# Altium schematic sheet 门禁改.SchDoc
size D
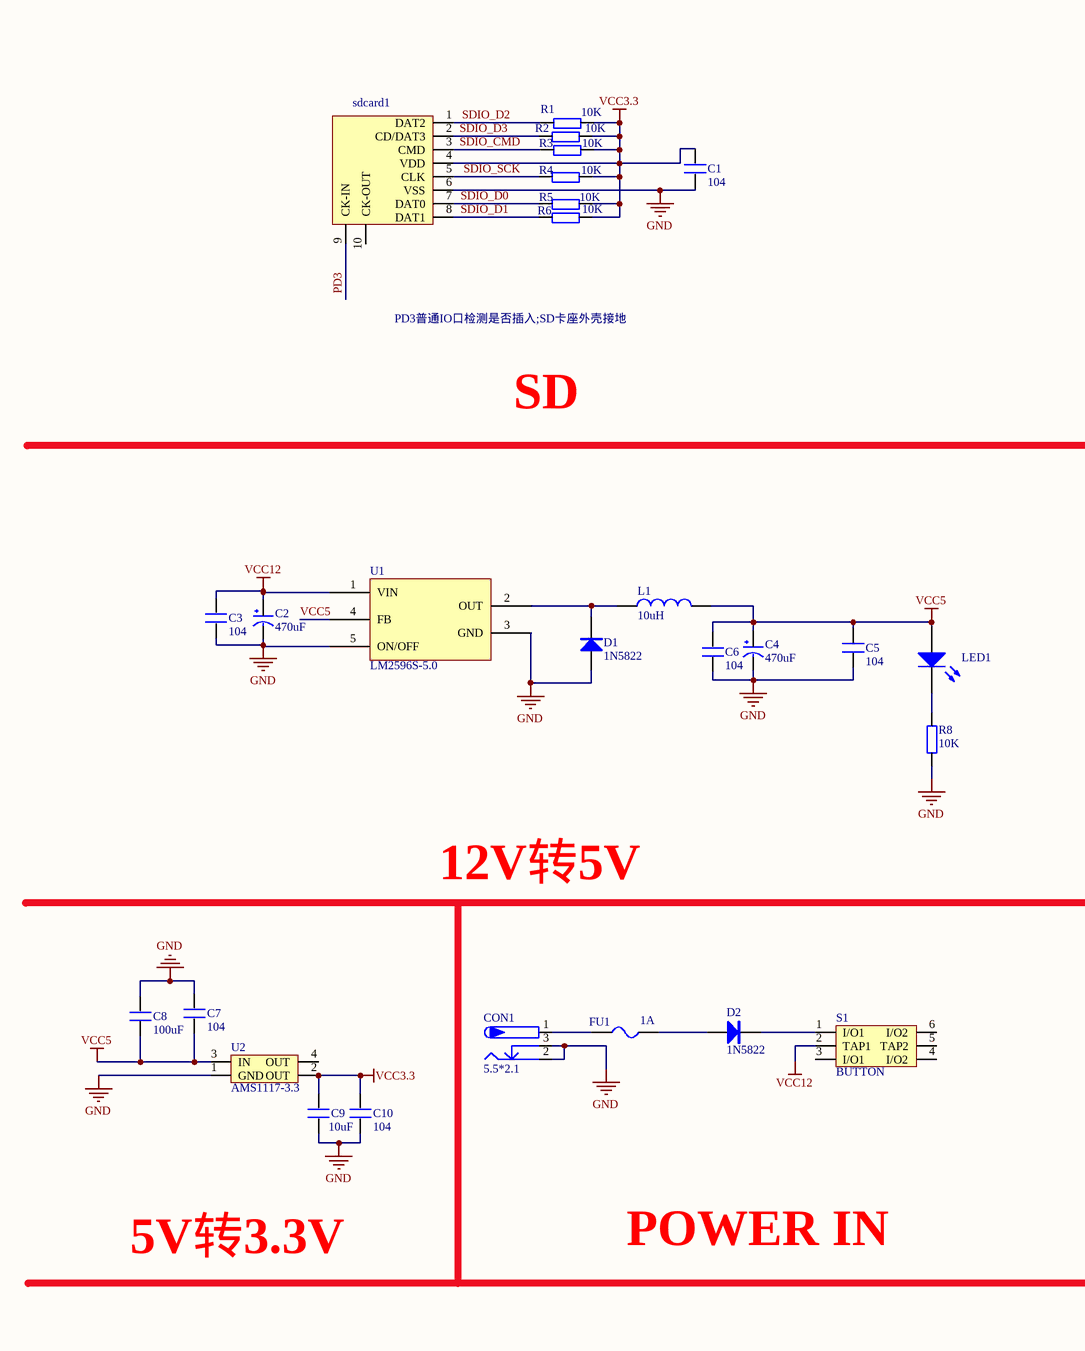
[diagram p0: 门禁改.SchDoc, top left]
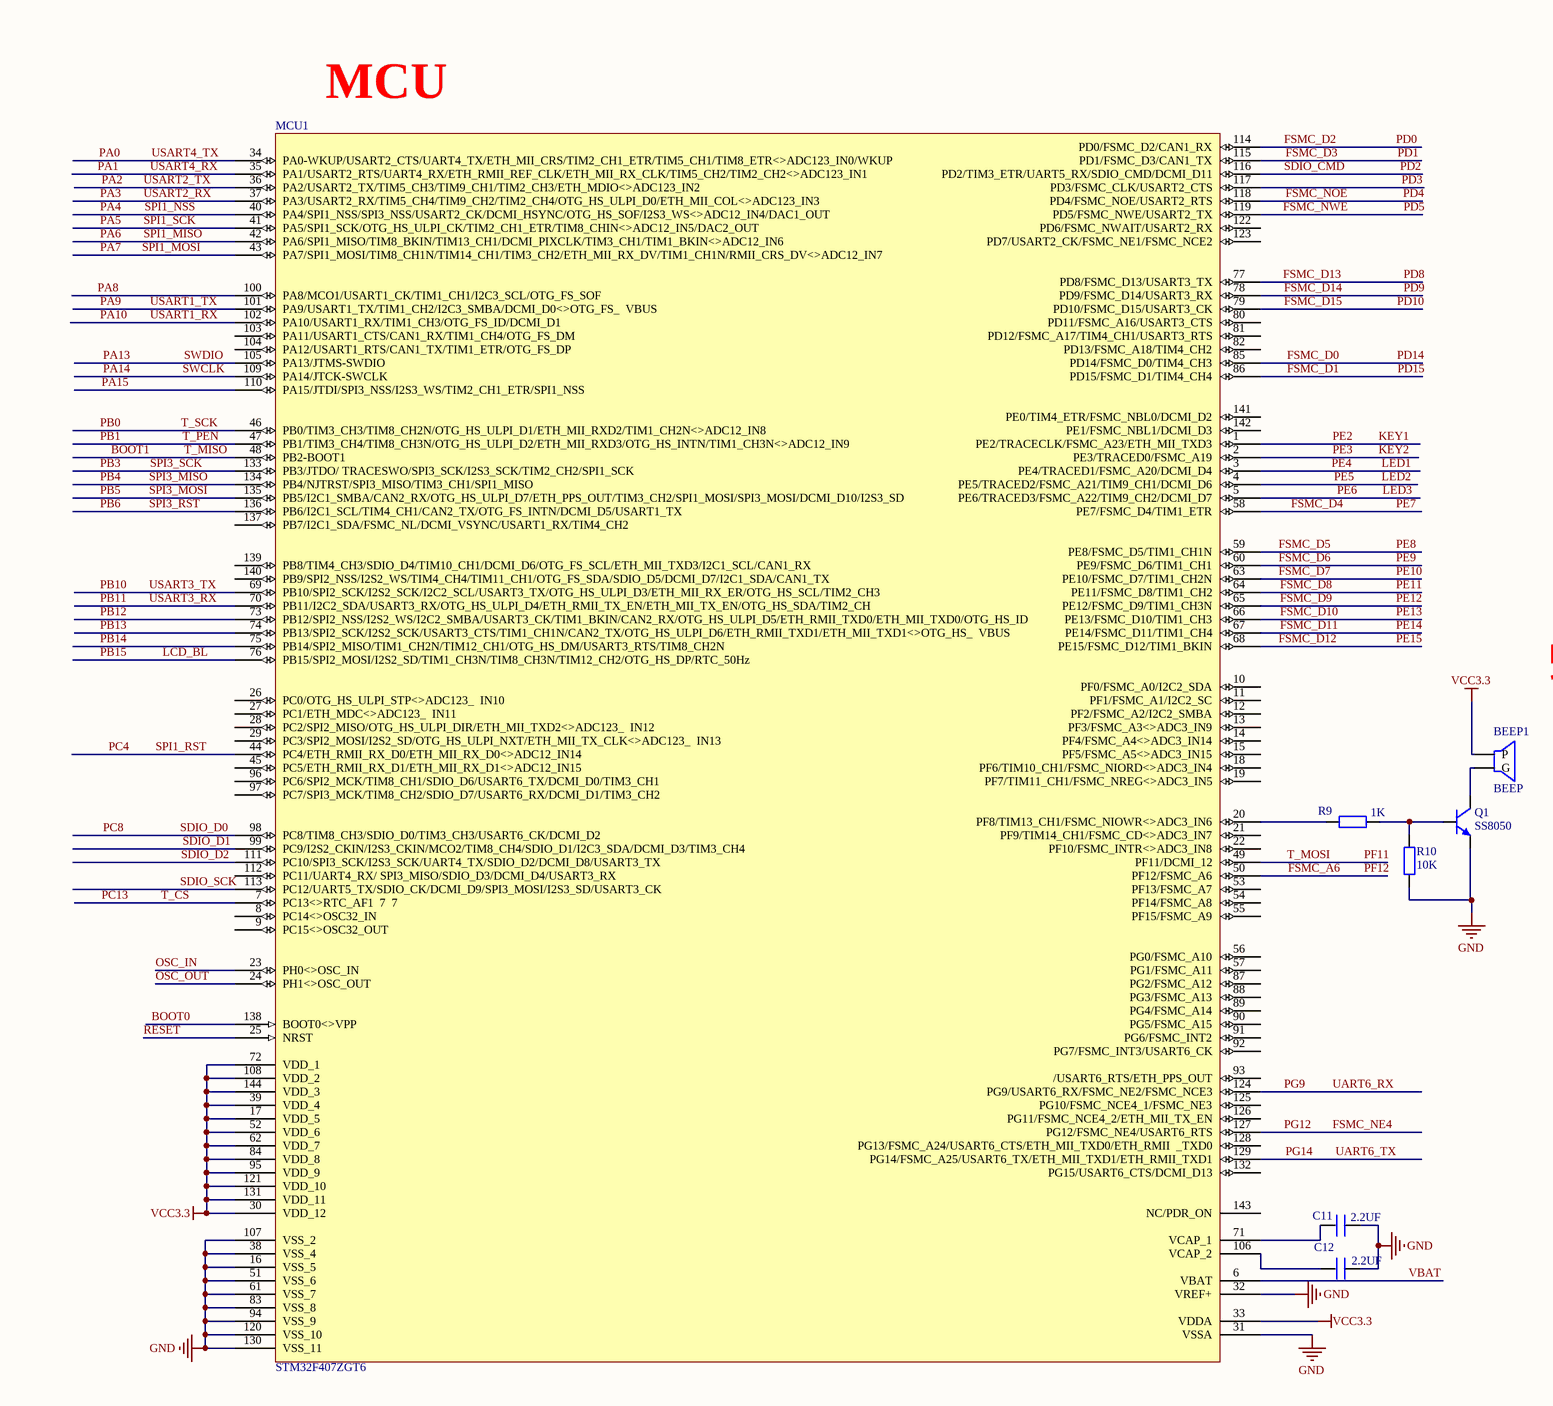
[diagram p1: 门禁改.SchDoc, top middle]
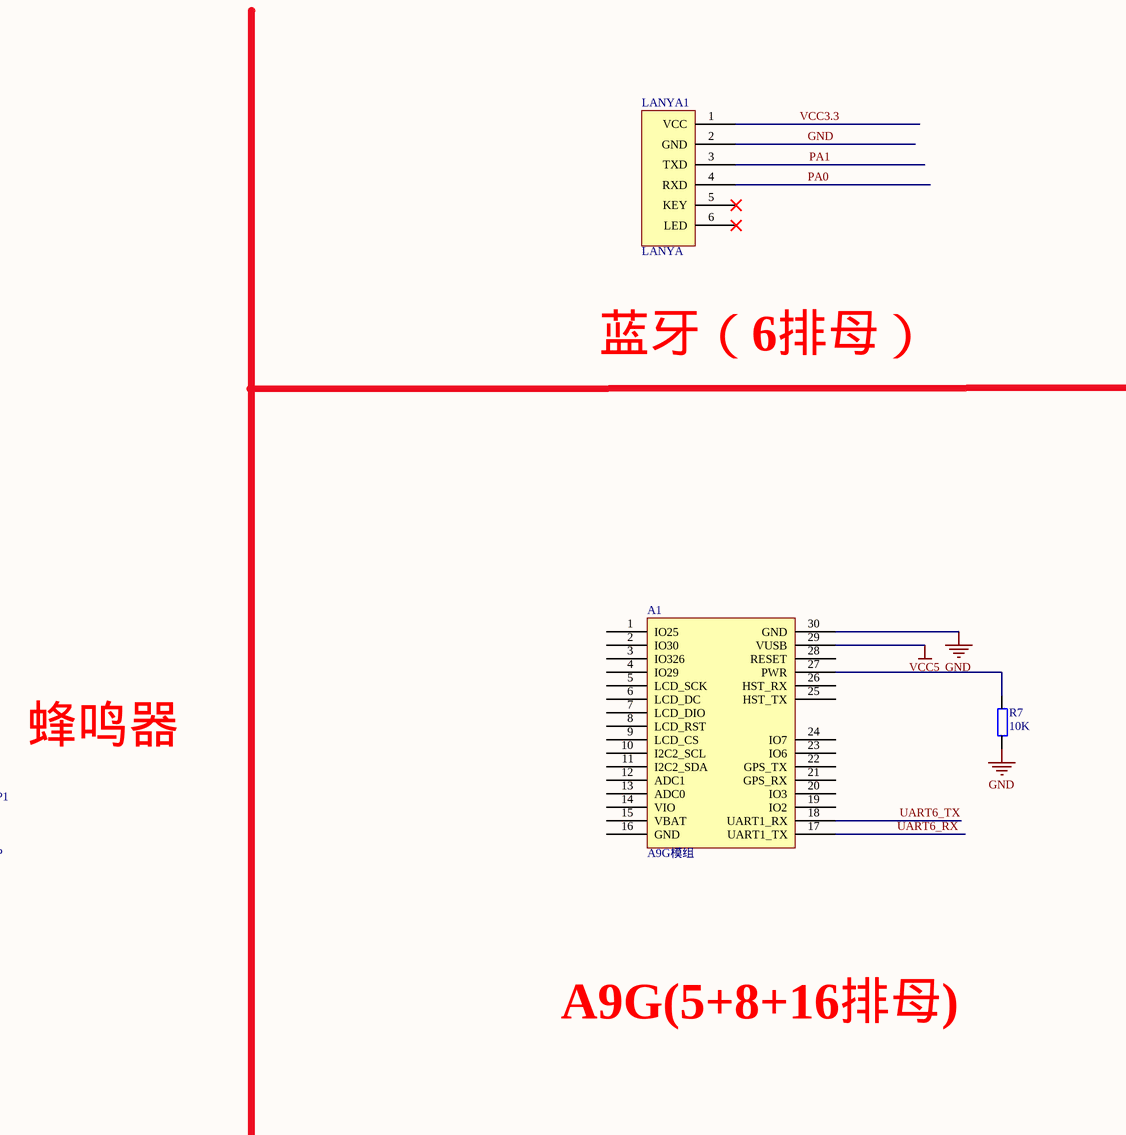
[diagram p2: 门禁改.SchDoc, top right]
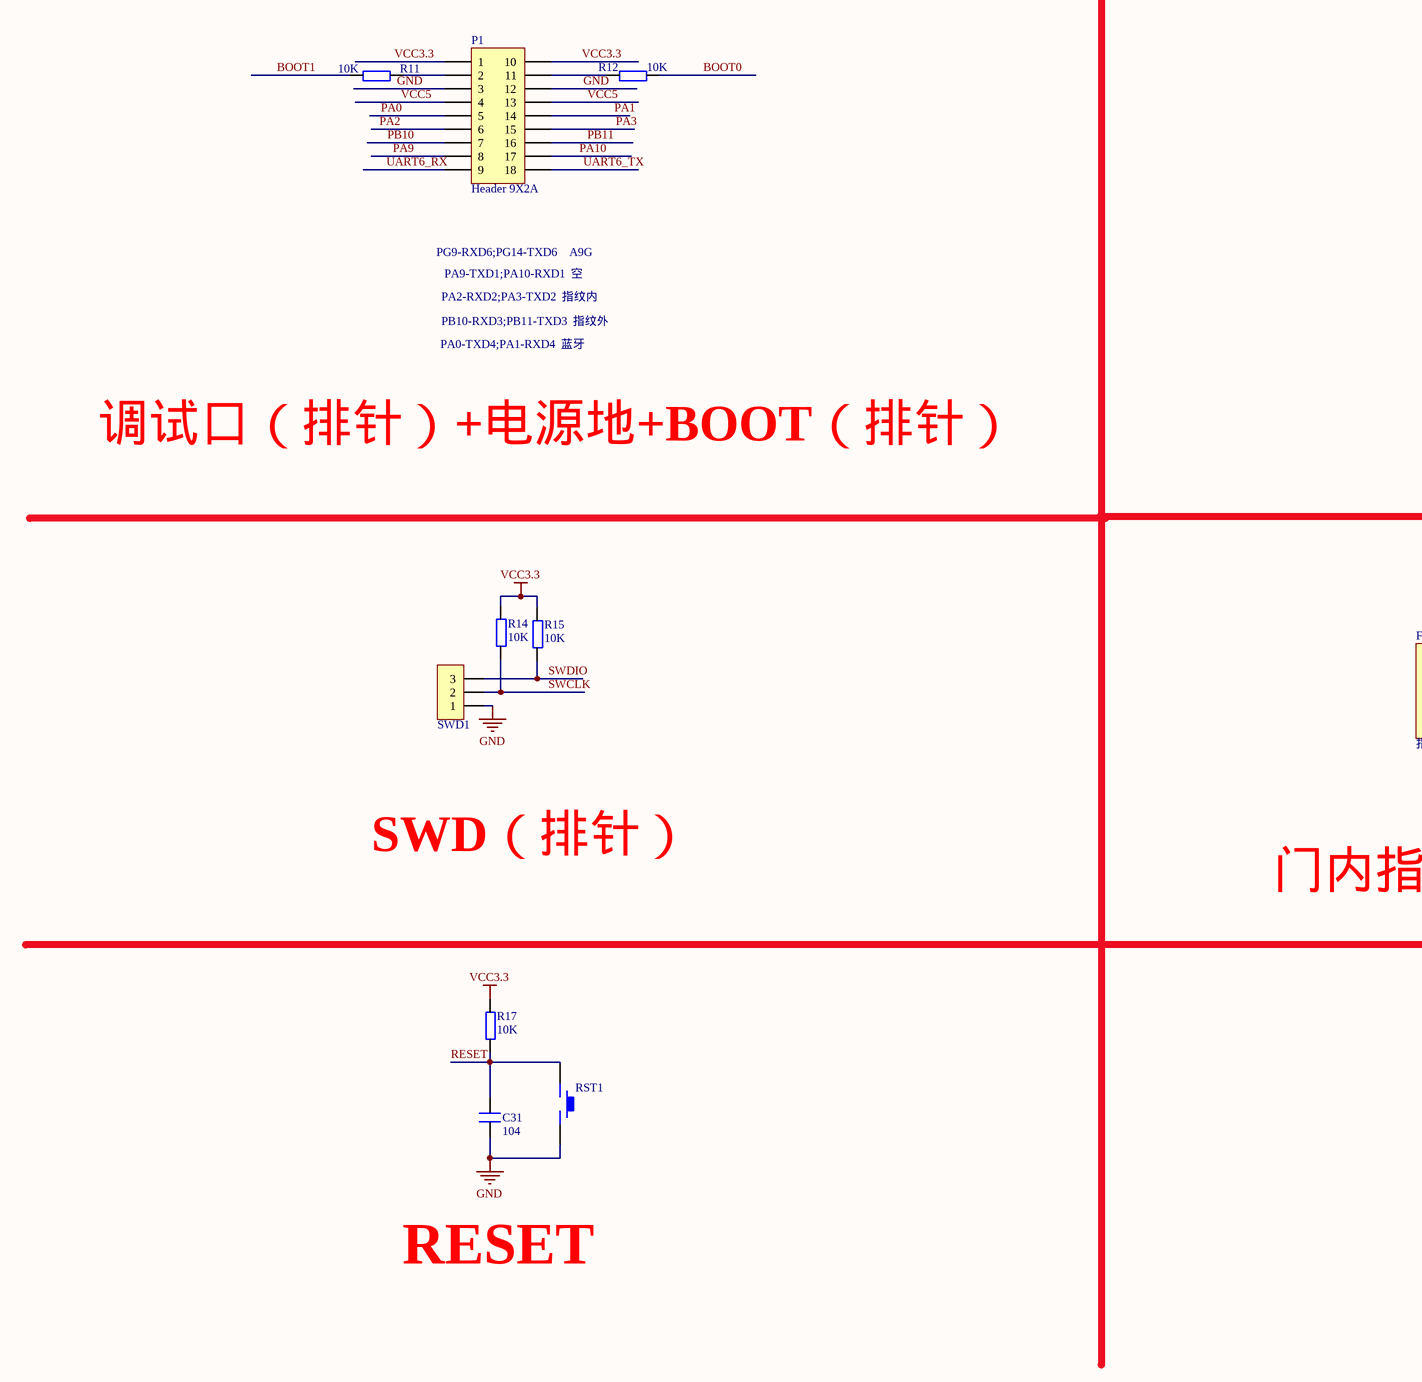
[diagram p3: 门禁改.SchDoc, bottom left]
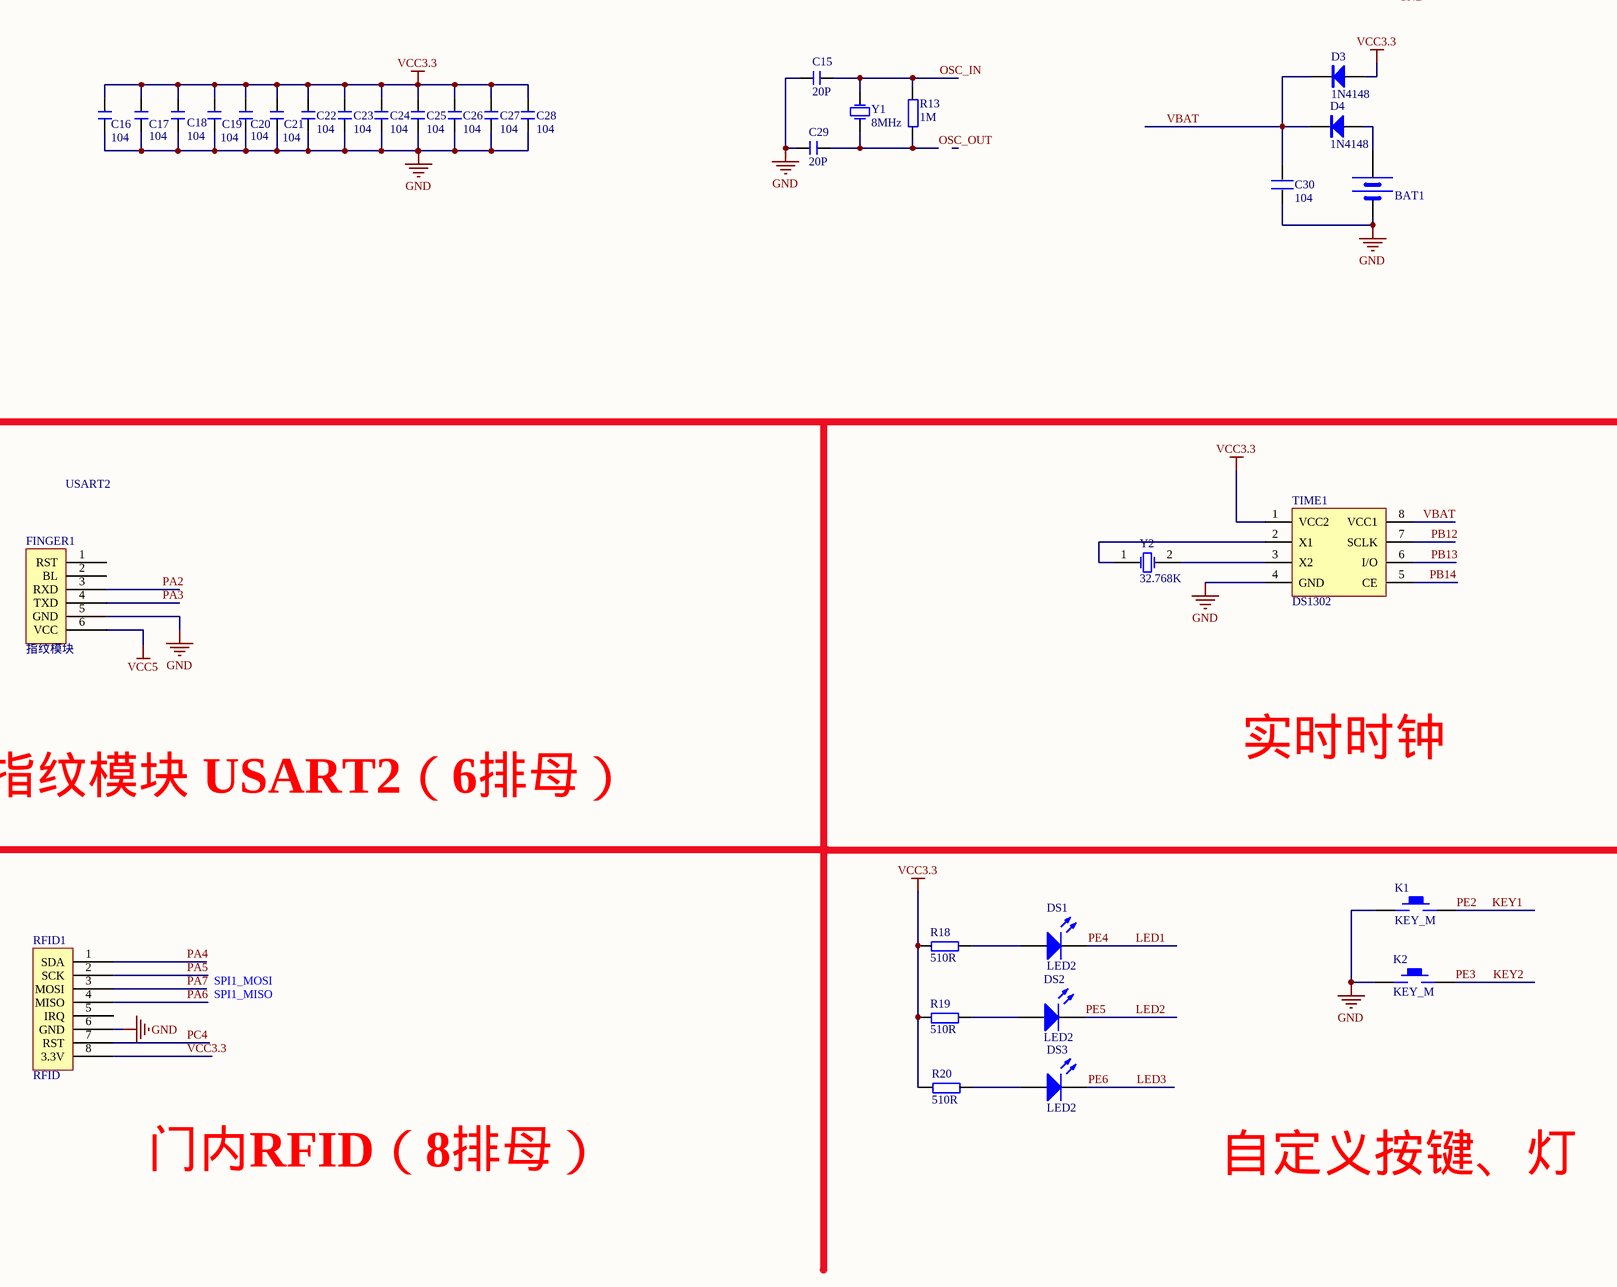
[diagram p4: 门禁改.SchDoc, bottom middle]
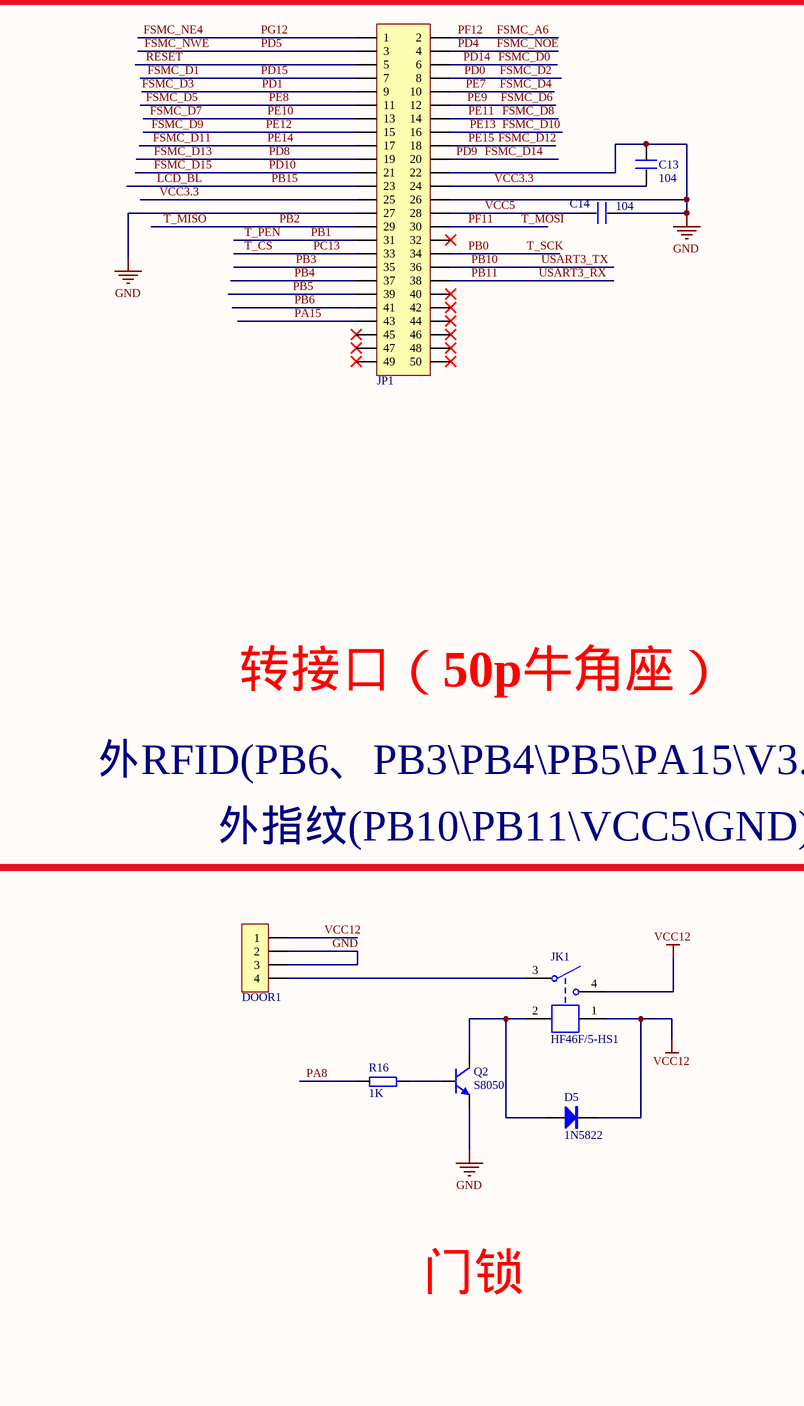
[diagram p5: 门禁改.SchDoc, bottom right]

## Parts
A1  A9G模组  [A9G]
BAT1  BATT  [BATMAX]  (value not drawn)
BEEP1  BEEP  [BUZZ]
C1  104  [0805]
C2  470uF  [CM F(10*10.2)]
C3  104  [0805]
C4  470uF  [CM F(10*10.2)]
C5  104  [0805]
C6  104  [0805]
C7  104  [0603P]
C8  100uF  [CM D(6.3*7.7)]
C9  10uF  [0603P]
C10  104  [0603P]
C11  2.2UF  [0805]
C12  2.2UF  [0805]
C13  104  [0805]
C14  104  [0805]
C15  20P  [0805]
C16  104  [0805]
C17  104  [0805]
C18  104  [0805]
C19  104  [0805]
C20  104  [0805]
C21  104  [0805]
C22  104  [0805]
C23  104  [0805]
C24  104  [0805]
C25  104  [0805]
C26  104  [0805]
C27  104  [0805]
C28  104  [0805]
C29  20P  [0805]
C30  104  [0805]
C31  104  [0805]
CON1  5.5*2.1  [DC-005]
D1  1N5822  [DIODE_3*5.3]
D2  1N5822  [DIODE_3*5.3]
D3  1N4148  [DIODE_3*5.3]
D4  1N4148  [DIODE_3*5.3]
D5  1N5822  [DIODE_3*5.3]
DOOR1  HDR-1X4  [XH2.54-WI-4P]  (value not drawn)
DS1  LED2  [SMDLED]
DS2  LED2  [SMDLED]
DS3  LED2  [SMDLED]
FINGER1  指纹模块  [指纹]
FU1  1A  [FU 1812]
JK1  HF46F/5-HS1  [HF46-xx-HS1]
JP1  Header 2X25  [IDC2.54-LI-2x25P]  (value not drawn)
K1  KEY_M  [KEY_M]
K2  KEY_M  [KEY_M]
L1  10uH  [0805]
LANYA1  LANYA  [蓝牙]
LED1  LED1  [SMDLED]  (value not drawn)
MCU1  STM32F407ZGT6  [LQFP144]
P1  Header 9X2A  [HDR2X9_CEN]
Q1  SS8050  [SOT23-3N]
Q2  S8050  [SOT23-3N]
R1  10K  [0805]
R2  10K  [0805]
R3  10K  [0805]
R4  10K  [0805]
R5  10K  [0805]
R6  10K  [0805]
R7  10K  [0805]
R8  10K  [0805]
R9  1K  [0805]
R10  10K  [0805]
R11  10K  [0805]
R12  10K  [0805]
R13  1M  [0805]
R14  10K  [0805]
R15  10K  [0805]
R16  1K  [0805]
R17  10K  [0805]
R18  510R  [0805]
R19  510R  [0805]
R20  510R  [0805]
RFID1  RFID  [RFID]
RST1  (no value)  [KEY_M]
S1  BUTTON  [BTN8.5*8.5]
sdcard1  sdIO-sdcard  [sdcard_2]  (value not drawn)
SWD1  HDR-1X3  [HDR2.54-LI-3P]  (value not drawn)
TIME1  DS1302  [SOP8_N]
U1  LM2596S-5.0  [TO263-5A]
U2  AMS1117-3.3  [AMS1117]
Y1  8MHz  [XTAL_T]
Y2  32.768K  [XTAL32]

## Nets
GND: A1.30(GND) BAT1.2(GND) C1.1 C2.2(GND) C3.1 C4.2(GND) C5.1 C6.1 C7.2 C8.2 C9.1 C10.1 C11.2 C12.2 C13.2 C14.1 C15.2 C16.1 C17.1 C18.1 C19.1 C20.1 C21.1 C22.1 C23.1 C24.1 C25.1 C26.1 C27.1 C28.1 C29.2 C30.1 C31.1 CON1.2 CON1.3 D1.1(A) DOOR1.2 DOOR1.3 FINGER1.5(GND) JP1.22 JP1.26 JP1.27 K1.1 K2.1 LANYA1.2(GND) MCU1.16(VSS_5) MCU1.31(VSSA) MCU1.32(VREF+) MCU1.38(VSS_4) MCU1.51(VSS_6) MCU1.61(VSS_7) MCU1.83(VSS_8) MCU1.94(VSS_9) MCU1.107(VSS_2) MCU1.120(VSS_10) MCU1.130(VSS_11) P1.3 P1.12 Q1.2(E) Q2.2(E) R7.1 R8.1 R10.1 RFID1.6(GND) RST1.2 sdcard1.6(VSS) SWD1.1 TIME1.4(GND) U1.3(GND) U1.5(ON/OFF) U2.1(GND)
VCC3.3: BEEP1.1(P) C1.2 C9.2 C10.2 C13.1 C16.2 C17.2 C18.2 C19.2 C20.2 C21.2 C22.2 C23.2 C24.2 C25.2 C26.2 C27.2 C28.2 D3.1(A) JP1.24 JP1.25 LANYA1.1(VCC) MCU1.17(VDD_5) MCU1.30(VDD_12) MCU1.33(VDDA) MCU1.39(VDD_4) MCU1.52(VDD_6) MCU1.62(VDD_7) MCU1.72(VDD_1) MCU1.84(VDD_8) MCU1.95(VDD_9) MCU1.108(VDD_2) MCU1.121(VDD_10) MCU1.131(VDD_11) MCU1.144(VDD_3) P1.1 P1.10 R1.2 R2.2 R3.2 R4.2 R5.2 R6.2 R14.2 R15.2 R17.2 R18.1 R19.1 R20.1 RFID1.8(3.3V) sdcard1.4(VDD) TIME1.1(VCC2) U2.2(OUT)
VCC5: A1.29(VUSB) C4.1(VCC) C5.2 C6.2 C7.1 C8.1 C14.2 FINGER1.6(VCC) JP1.28 L1.2 LED1.1(A) P1.4 P1.13 U1.4(FB) U2.3(IN)
VCC12: C2.1(VCC) C3.2 D5.2(K) DOOR1.1 JK1.1 JK1.4 S1.2(TAP1) U1.1(VIN)
BOOT0: MCU1.138(BOOT0<>VPP) R12.2
BOOT1: JP1.29 MCU1.48(PB2-BOOT1) R11.1  [also labelled PB2, T_MISO]
FSMC_A6: JP1.2 MCU1.50(PF12/FSMC_A6)  [also labelled PF12]
FSMC_D0: JP1.6 MCU1.85(PD14/FSMC_D0/TIM4_CH3)  [also labelled PD14]
FSMC_D1: JP1.7 MCU1.86(PD15/FSMC_D1/TIM4_CH4)  [also labelled PD15]
FSMC_D2: JP1.8 MCU1.114(PD0/FSMC_D2/CAN1_RX)  [also labelled PD0]
FSMC_D3: JP1.9 MCU1.115(PD1/FSMC_D3/CAN1_TX)  [also labelled PD1]
FSMC_D4: JP1.10 MCU1.58(PE7/FSMC_D4/TIM1_ETR)  [also labelled PE7]
FSMC_D5: JP1.11 MCU1.59(PE8/FSMC_D5/TIM1_CH1N)  [also labelled PE8]
FSMC_D6: JP1.12 MCU1.60(PE9/FSMC_D6/TIM1_CH1)  [also labelled PE9]
FSMC_D7: JP1.13 MCU1.63(PE10/FSMC_D7/TIM1_CH2N)  [also labelled PE10]
FSMC_D8: JP1.14 MCU1.64(PE11/FSMC_D8/TIM1_CH2)  [also labelled PE11]
FSMC_D9: JP1.15 MCU1.65(PE12/FSMC_D9/TIM1_CH3N)  [also labelled PE12]
FSMC_D10: JP1.16 MCU1.66(PE13/FSMC_D10/TIM1_CH3)  [also labelled PE13]
FSMC_D11: JP1.17 MCU1.67(PE14/FSMC_D11/TIM1_CH4)  [also labelled PE14]
FSMC_D12: JP1.18 MCU1.68(PE15/FSMC_D12/TIM1_BKIN)  [also labelled PE15]
FSMC_D13: JP1.19 MCU1.77(PD8/FSMC_D13/USART3_TX)  [also labelled PD8]
FSMC_D14: JP1.20 MCU1.78(PD9/FSMC_D14/USART3_RX)  [also labelled PD9]
FSMC_D15: JP1.21 MCU1.79(PD10/FSMC_D15/USART3_CK)  [also labelled PD10]
FSMC_NE4: JP1.1 MCU1.127(PG12/FSMC_NE4/USART6_RTS)  [also labelled PG12]
FSMC_NOE: JP1.4 MCU1.118(PD4/FSMC_NOE/USART2_RTS)  [also labelled PD4]
FSMC_NWE: JP1.3 MCU1.119(PD5/FSMC_NWE/USART2_TX)  [also labelled PD5]
KEY1: K1.2 MCU1.1(PE2/TRACECLK/FSMC_A23/ETH_MII_TXD3)  [also labelled PE2]
KEY2: K2.2 MCU1.2(PE3/TRACED0/FSMC_A19)  [also labelled PE3]
LCD_BL: JP1.23 MCU1.76(PB15/SPI2_MOSI/I2S2_SD/TIM1_CH3N/TIM8_CH3N/TIM12_CH2/OTG_HS_DP/RTC_50Hz)  [also labelled PB15]
LED1: DS1.2(K) MCU1.3(PE4/TRACED1/FSMC_A20/DCMI_D4)  [also labelled PE4]
LED2: DS2.2(K) MCU1.4(PE5/TRACED2/FSMC_A21/TIM9_CH1/DCMI_D6)  [also labelled PE5]
LED3: DS3.2(K) MCU1.5(PE6/TRACED3/FSMC_A22/TIM9_CH2/DCMI_D7)  [also labelled PE6]
OSC_IN: C15.1 MCU1.23(PH0<>OSC_IN) R13.2 Y1.2(OSC2)
OSC_OUT: C29.1 MCU1.24(PH1<>OSC_OUT) R13.1 Y1.1(OSC1)
PA0: LANYA1.4(RXD) MCU1.34(PA0-WKUP/USART2_CTS/UART4_TX/ETH_MII_CRS/TIM2_CH1_ETR/TIM5_CH1/TIM8_ETR<>ADC123_IN0/WKUP) P1.5  [also labelled USART4_TX]
PA1: LANYA1.3(TXD) MCU1.35(PA1/USART2_RTS/UART4_RX/ETH_RMII_REF_CLK/ETH_MII_RX_CLK/TIM5_CH2/TIM2_CH2<>ADC123_IN1) P1.14  [also labelled USART4_RX]
PA2: FINGER1.3(RXD) MCU1.36(PA2/USART2_TX/TIM5_CH3/TIM9_CH1/TIM2_CH3/ETH_MDIO<>ADC123_IN2) P1.6  [also labelled USART2_TX]
PA3: FINGER1.4(TXD) MCU1.37(PA3/USART2_RX/TIM5_CH4/TIM9_CH2/TIM2_CH4/OTG_HS_ULPI_D0/ETH_MII_COL<>ADC123_IN3) P1.15  [also labelled USART2_RX]
PA4: MCU1.40(PA4/SPI1_NSS/SPI3_NSS/USART2_CK/DCMI_HSYNC/OTG_HS_SOF/I2S3_WS<>ADC12_IN4/DAC1_OUT) RFID1.1(SDA)  [also labelled SPI1_NSS]
PA5: MCU1.41(PA5/SPI1_SCK/OTG_HS_ULPI_CK/TIM2_CH1_ETR/TIM8_CHIN<>ADC12_IN5/DAC2_OUT) RFID1.2(SCK)  [also labelled SPI1_SCK]
PA6: MCU1.42(PA6/SPI1_MISO/TIM8_BKIN/TIM13_CH1/DCMI_PIXCLK/TIM3_CH1/TIM1_BKIN<>ADC12_IN6) RFID1.4(MISO)  [also labelled SPI1_MISO]
PA7: MCU1.43(PA7/SPI1_MOSI/TIM8_CH1N/TIM14_CH1/TIM3_CH2/ETH_MII_RX_DV/TIM1_CH1N/RMII_CRS_DV<>ADC12_IN7) RFID1.3(MOSI)  [also labelled SPI1_MOSI]
PA8: MCU1.100(PA8/MCO1/USART1_CK/TIM1_CH1/I2C3_SCL/OTG_FS_SOF) R16.1
PA9: MCU1.101(PA9/USART1_TX/TIM1_CH2/I2C3_SMBA/DCMI_D0<>OTG_FS___VBUS) P1.8  [also labelled USART1_TX]
PA10: MCU1.102(PA10/USART1_RX/TIM1_CH3/OTG_FS_ID/DCMI_D1) P1.17  [also labelled USART1_RX]
PA13: MCU1.105(PA13/JTMS-SWDIO) R15.1 SWD1.3  [also labelled SWDIO]
PA14: MCU1.109(PA14/JTCK-SWCLK) R14.1 SWD1.2  [also labelled SWCLK]
PA15: JP1.43 MCU1.110(PA15/JTDI/SPI3_NSS/I2S3_WS/TIM2_CH1_ETR/SPI1_NSS)
PB0: JP1.34 MCU1.46(PB0/TIM3_CH3/TIM8_CH2N/OTG_HS_ULPI_D1/ETH_MII_RXD2/TIM1_CH2N<>ADC12_IN8)  [also labelled T_SCK]
PB1: JP1.31 MCU1.47(PB1/TIM3_CH4/TIM8_CH3N/OTG_HS_ULPI_D2/ETH_MII_RXD3/OTG_HS_INTN/TIM1_CH3N<>ADC12_IN9)  [also labelled T_PEN]
PB3: JP1.35 MCU1.133(PB3/JTDO/_TRACESWO/SPI3_SCK/I2S3_SCK/TIM2_CH2/SPI1_SCK)  [also labelled SPI3_SCK]
PB4: JP1.37 MCU1.134(PB4/NJTRST/SPI3_MISO/TIM3_CH1/SPI1_MISO)  [also labelled SPI3_MISO]
PB5: JP1.39 MCU1.135(PB5/I2C1_SMBA/CAN2_RX/OTG_HS_ULPI_D7/ETH_PPS_OUT/TIM3_CH2/SPI1_MOSI/SPI3_MOSI/DCMI_D10/I2S3_SD)  [also labelled SPI3_MOSI]
PB6: JP1.41 MCU1.136(PB6/I2C1_SCL/TIM4_CH1/CAN2_TX/OTG_FS_INTN/DCMI_D5/USART1_TX)  [also labelled SPI3_RST]
PB10: JP1.36 MCU1.69(PB10/SPI2_SCK/I2S2_SCK/I2C2_SCL/USART3_TX/OTG_HS_ULPI_D3/ETH_MII_RX_ER/OTG_HS_SCL/TIM2_CH3) P1.7  [also labelled USART3_TX]
PB11: JP1.38 MCU1.70(PB11/I2C2_SDA/USART3_RX/OTG_HS_ULPI_D4/ETH_RMII_TX_EN/ETH_MII_TX_EN/OTG_HS_SDA/TIM2_CH) P1.16  [also labelled USART3_RX]
PB12: MCU1.73(PB12/SPI2_NSS/I2S2_WS/I2C2_SMBA/USART3_CK/TIM1_BKIN/CAN2_RX/OTG_HS_ULPI_D5/ETH_RMII_TXD0/ETH_MII_TXD0/OTG_HS_ID) TIME1.7(SCLK)
PB13: MCU1.74(PB13/SPI2_SCK/I2S2_SCK/USART3_CTS/TIM1_CH1N/CAN2_TX/OTG_HS_ULPI_D6/ETH_RMII_TXD1/ETH_MII_TXD1<>OTG_HS___VBUS) TIME1.6(I/O)
PB14: MCU1.75(PB14/SPI2_MISO/TIM1_CH2N/TIM12_CH1/OTG_HS_DM/USART3_RTS/TIM8_CH2N) TIME1.5(CE)
PC4: MCU1.44(PC4/ETH_RMII_RX_D0/ETH_MII_RX_D0<>ADC12_IN14) RFID1.7(RST)  [also labelled SPI1_RST]
PC8: MCU1.98(PC8/TIM8_CH3/SDIO_D0/TIM3_CH3/USART6_CK/DCMI_D2) R5.1 sdcard1.7(DAT0)  [also labelled SDIO_D0]
PC13: JP1.33 MCU1.7(PC13<>RTC_AF1__7__7)  [also labelled T_CS]
PD2: MCU1.116(PD2/TIM3_ETR/UART5_RX/SDIO_CMD/DCMI_D11) R3.1 sdcard1.3(CMD)  [also labelled SDIO_CMD]
PD3: MCU1.117(PD3/FSMC_CLK/USART2_CTS) sdcard1.9(CK-IN)
PF11: JP1.30 MCU1.49(PF11/DCMI_12)  [also labelled T_MOSI]
PG9: A1.17(UART1_TX) MCU1.124(PG9/USART6_RX/FSMC_NE2/FSMC_NCE3) P1.9  [also labelled UART6_RX]
PG14: A1.18(UART1_RX) MCU1.129(PG14/FSMC_A25/USART6_TX/ETH_MII_TXD1/ETH_RMII_TXD1) P1.18  [also labelled UART6_TX]
RESET: C31.2 JP1.5 MCU1.25(NRST) R17.1 RST1.1
SDIO_D1: MCU1.99(PC9/I2S2_CKIN/I2S3_CKIN/MCO2/TIM8_CH4/SDIO_D1/I2C3_SDA/DCMI_D3/TIM3_CH4) R6.1 sdcard1.8(DAT1)
SDIO_D2: MCU1.111(PC10/SPI3_SCK/I2S3_SCK/UART4_TX/SDIO_D2/DCMI_D8/USART3_TX) R1.1 sdcard1.1(DAT2)
SDIO_D3: R2.1 sdcard1.2(CD/DAT3)
SDIO_SCK: MCU1.113(PC12/UART5_TX/SDIO_CK/DCMI_D9/SPI3_MOSI/I2S3_SD/USART3_CK) R4.1 sdcard1.5(CLK)
VBAT: C30.2 D3.2(K) D4.2(K) MCU1.6(VBAT) TIME1.8(VCC1)
NetA1_27: A1.27(PWR) R7.2
NetBAT1_1: BAT1.1(VCC) D4.1(A)
NetBEEP1_2: BEEP1.2(G) Q1.3(C)
NetC11_1: C11.1 MCU1.71(VCAP_1)
NetC12_1: C12.1 MCU1.106(VCAP_2)
NetCON1_1: CON1.1 FU1.1
NetD1_2: D1.2(K) L1.1 U1.2(OUT)
NetD2_1: D2.1(A) FU1.2
NetD2_2: D2.2(K) S1.1(I/O1)
NetD5_1: D5.1(A) JK1.2 Q2.3(C)
NetDOOR1_4: DOOR1.4 JK1.3
NetDS1_1: DS1.1(A) R18.2
NetDS2_1: DS2.1(A) R19.2
NetDS3_1: DS3.1(A) R20.2
NetLED1_2: LED1.2(K) R8.2
NetMCU1_20: MCU1.20(PF8/TIM13_CH1/FSMC_NIOWR<>ADC3_IN6) R9.1
NetP1_2: P1.2 R11.2
NetP1_11: P1.11 R12.1
NetQ1_1: Q1.1(B) R9.2 R10.2
NetQ2_1: Q2.1(B) R16.2
NetTIME1_2: TIME1.2(X1) Y2.1(OSC1)
NetTIME1_3: TIME1.3(X2) Y2.2(OSC2)

Not connected (* = marked no-connect by the designer): A1 1(IO25) 2(IO30) 3(IO326) 4(IO29) 5(LCD_SCK) 6(LCD_DC) 7(LCD_DIO) 8(LCD_RST) 9(LCD_CS) 10(I2C2_SCL) 11(I2C2_SDA) 12(ADC1) 13(ADC0) 14(VIO) 15(VBAT) 16(GND) 19(IO2) 20(IO3) 21(GPS_RX) 22(GPS_TX) 23(IO6) 24(IO7) 25(HST_TX) 26(HST_RX) 28(RESET); FINGER1 1(RST) 2(BL); JP1 32* 40* 42* 44* 45* 46* 47* 48* 49* 50*; LANYA1 5(KEY)* 6(LED)*; MCU1 8(PC14<>OSC32_IN) 9(PC15<>OSC32_OUT) 10(PF0/FSMC_A0/I2C2_SDA) 11(PF1/FSMC_A1/I2C2_SC) 12(PF2/FSMC_A2/I2C2_SMBA) 13(PF3/FSMC_A3<>ADC3_IN9) 14(PF4/FSMC_A4<>ADC3_IN14) 15(PF5/FSMC_A5<>ADC3_IN15) 18(PF6/TIM10_CH1/FSMC_NIORD<>ADC3_IN4) 19(PF7/TIM11_CH1/FSMC_NREG<>ADC3_IN5) 21(PF9/TIM14_CH1/FSMC_CD<>ADC3_IN7) 22(PF10/FSMC_INTR<>ADC3_IN8) 26(PC0/OTG_HS_ULPI_STP<>ADC123___IN10) 27(PC1/ETH_MDC<>ADC123___IN11) 28(PC2/SPI2_MISO/OTG_HS_ULPI_DIR/ETH_MII_TXD2<>ADC123___IN12) 29(PC3/SPI2_MOSI/I2S2_SD/OTG_HS_ULPI_NXT/ETH_MII_TX_CLK<>ADC123___IN13) 45(PC5/ETH_RMII_RX_D1/ETH_MII_RX_D1<>ADC12_IN15) 53(PF13/FSMC_A7) 54(PF14/FSMC_A8) 55(PF15/FSMC_A9) 56(PG0/FSMC_A10) 57(PG1/FSMC_A11) 80(PD11/FSMC_A16/USART3_CTS) 81(PD12/FSMC_A17/TIM4_CH1/USART3_RTS) 82(PD13/FSMC_A18/TIM4_CH2) 87(PG2/FSMC_A12) 88(PG3/FSMC_A13) 89(PG4/FSMC_A14) 90(PG5/FSMC_A15) 91(PG6/FSMC_INT2) 92(PG7/FSMC_INT3/USART6_CK) 93(/USART6_RTS/ETH_PPS_OUT) 96(PC6/SPI2_MCK/TIM8_CH1/SDIO_D6/USART6_TX/DCMI_D0/TIM3_CH1) 97(PC7/SPI3_MCK/TIM8_CH2/SDIO_D7/USART6_RX/DCMI_D1/TIM3_CH2) 103(PA11/USART1_CTS/CAN1_RX/TIM1_CH4/OTG_FS_DM) 104(PA12/USART1_RTS/CAN1_TX/TIM1_ETR/OTG_FS_DP) 112(PC11/UART4_RX/_SPI3_MISO/SDIO_D3/DCMI_D4/USART3_RX) 122(PD6/FSMC_NWAIT/USART2_RX) 123(PD7/USART2_CK/FSMC_NE1/FSMC_NCE2) 125(PG10/FSMC_NCE4_1/FSMC_NE3) 126(PG11/FSMC_NCE4_2/ETH_MII_TX_EN) 128(PG13/FSMC_A24/USART6_CTS/ETH_MII_TXD0/ETH_RMII___TXD0) 132(PG15/USART6_CTS/DCMI_D13) 137(PB7/I2C1_SDA/FSMC_NL/DCMI_VSYNC/USART1_RX/TIM4_CH2) 139(PB8/TIM4_CH3/SDIO_D4/TIM10_CH1/DCMI_D6/OTG_FS_SCL/ETH_MII_TXD3/I2C1_SCL/CAN1_RX) 140(PB9/SPI2_NSS/I2S2_WS/TIM4_CH4/TIM11_CH1/OTG_FS_SDA/SDIO_D5/DCMI_D7/I2C1_SDA/CAN1_TX) 141(PE0/TIM4_ETR/FSMC_NBL0/DCMI_D2) 142(PE1/FSMC_NBL1/DCMI_D3) 143(NC/PDR_ON); RFID1 5(IRQ); S1 3(I/O1) 4(I/O2) 5(TAP2) 6(I/O2); sdcard1 10(CK-OUT); U2 4(OUT)

## Notes on the sheet
- (near MCU1) MCU
- PD3普通IO口检测是否插入;SD卡座外壳接地
- 蓝牙（6排母）
- SD
- 蜂鸣器
- 12V转5V
- A9G(5+8+16排母)
- 5V转3.3V
- POWER IN
- PG9-RXD6;PG14-TXD6    A9G
- PA2-RXD2;PA3-TXD2  指纹内
- PA9-TXD1;PA10-RXD1  空
- PA0-TXD4;PA1-RXD4  蓝牙
- PB10-RXD3;PB11-TXD3  指纹外
- 调试口（排针）+电源地+BOOT（排针）
- USART2
- 转接口（50p牛角座）
- 外RFID(PB6、PB3\PB4\PB5\PA15\V3.3\GND)
- 外指纹(PB10\PB11\VCC5\GND)
- SWD（排针）
- 门内指纹模块 USART2（6排母）
- 实时时钟
- SPI1_MISO
- SPI1_MOSI
- 门锁
- RESET
- 门内RFID（8排母）
- 自定义按键、灯

## Library data of the parts
BAT1 = BAT
C1 C3 C5-C10 C13 C14 C30 C31 = C
C2 C4 = CAP
C11 C12 = C_1
C15-C29 = C: 无极性贴片电容; 版权归属: 源创客; BOM名称: 无极性贴片电容; 学习资源: www.ooocke.com
CON1 = P-DC: 低压电源接口; BOM名称: DC电源接口; 版权归属: 源创客; 学习资源: www.ooocke.com
D1-D5 = 1N4148: 高速开关二极管; 版权归属: 源创客; BOM名称: 高速开关二极管; 学习资源: www.ooocke.com
DOOR1 = Header 4: 4P接插件; 版权归属: 源创客; BOM名称: 4P接插件; 学习资源: www.ooocke.com
DS1-DS3 LED1 = LED2: Typical RED, GREEN, YELLOW, AMBER GaAs LED
  DS1-DS3: Published: *; LatestRevisionDate: *; LatestRevisionNote: *; PackageDocument: *; PackageReference: *; Publisher: *
  LED1: Published: 8-Jun-2000; LatestRevisionDate: 17-Jul-2002; LatestRevisionNote: Re-released for DXP Platform.; PackageDocument: Feb-2002; PackageReference: 3.2X1.6X1.1; Publisher: Altium Limited
FU1 = FU: 贴片保险丝; 版权归属: 源创客; BOM名称: 贴片保险丝; 学习资源: www.ooocke.com
JK1 = HF46F/5-HS1: 5V一组常开; BOM名称: 5V继电器; 版权归属: 源创客; 学习资源: www.ooocke.com
JP1 = Header 25X2: 25*2P接插件; BOM名称: 20*2P接插件; 版权归属: 源创客; 学习资源: www.ooocke.com
L1 = L: 小功率贴片电感; 版权归属: 源创客; BOM名称: 小功率贴片电感; 学习资源: www.ooocke.com
LANYA1 = 蓝牙模块
P1 = Header 9X2A: Header, 9-Pin, Dual row; LatestRevisionDate: 17-Jul-2002; LatestRevisionNote: Re-released for DXP Platform.; Publisher: Altium Limited
Q1 Q2 = 8050-SMD: 高频放大-NPN型; 版权归属: 源创客; 属性: 40V 1.5A 1W 100MHZ; BOM名称: 高频放大-NPN型; 学习资源: www.ooocke.com
R1-R8 R11-R20 = R
R9 R10 = R: 贴片电阻; 版权归属: 源创客; BOM名称: 贴片电阻; 学习资源: www.ooocke.com
RFID1 = RC522
RST1 = KEY_M
SWD1 = Header 3: 3P接插件; 版权归属: 源创客; BOM名称: 3P接插件; 学习资源: www.ooocke.com
TIME1 = DS1302: 实时时钟芯片; 版权归属: 源创客; BOM名称: 实时时钟芯片; 学习资源: www.ooocke.com
U1 = Component_1: LM2576S-5.0
U2 = AMS1117
Y1 = XTAL_2: Crystal Oscillator; Published: 8-Jun-2000; LatestRevisionDate: 17-Jul-2002; LatestRevisionNote: Re-released for DXP Platform.; Publisher: Altium Limited
Y2 = XTAL_1: Crystal Oscillator; Published: 8-Jun-2000; LatestRevisionDate: 17-Jul-2002; LatestRevisionNote: Re-released for DXP Platform.; Publisher: Altium Limited